# EasyEDA schematic 4BitComputerSchematic.json
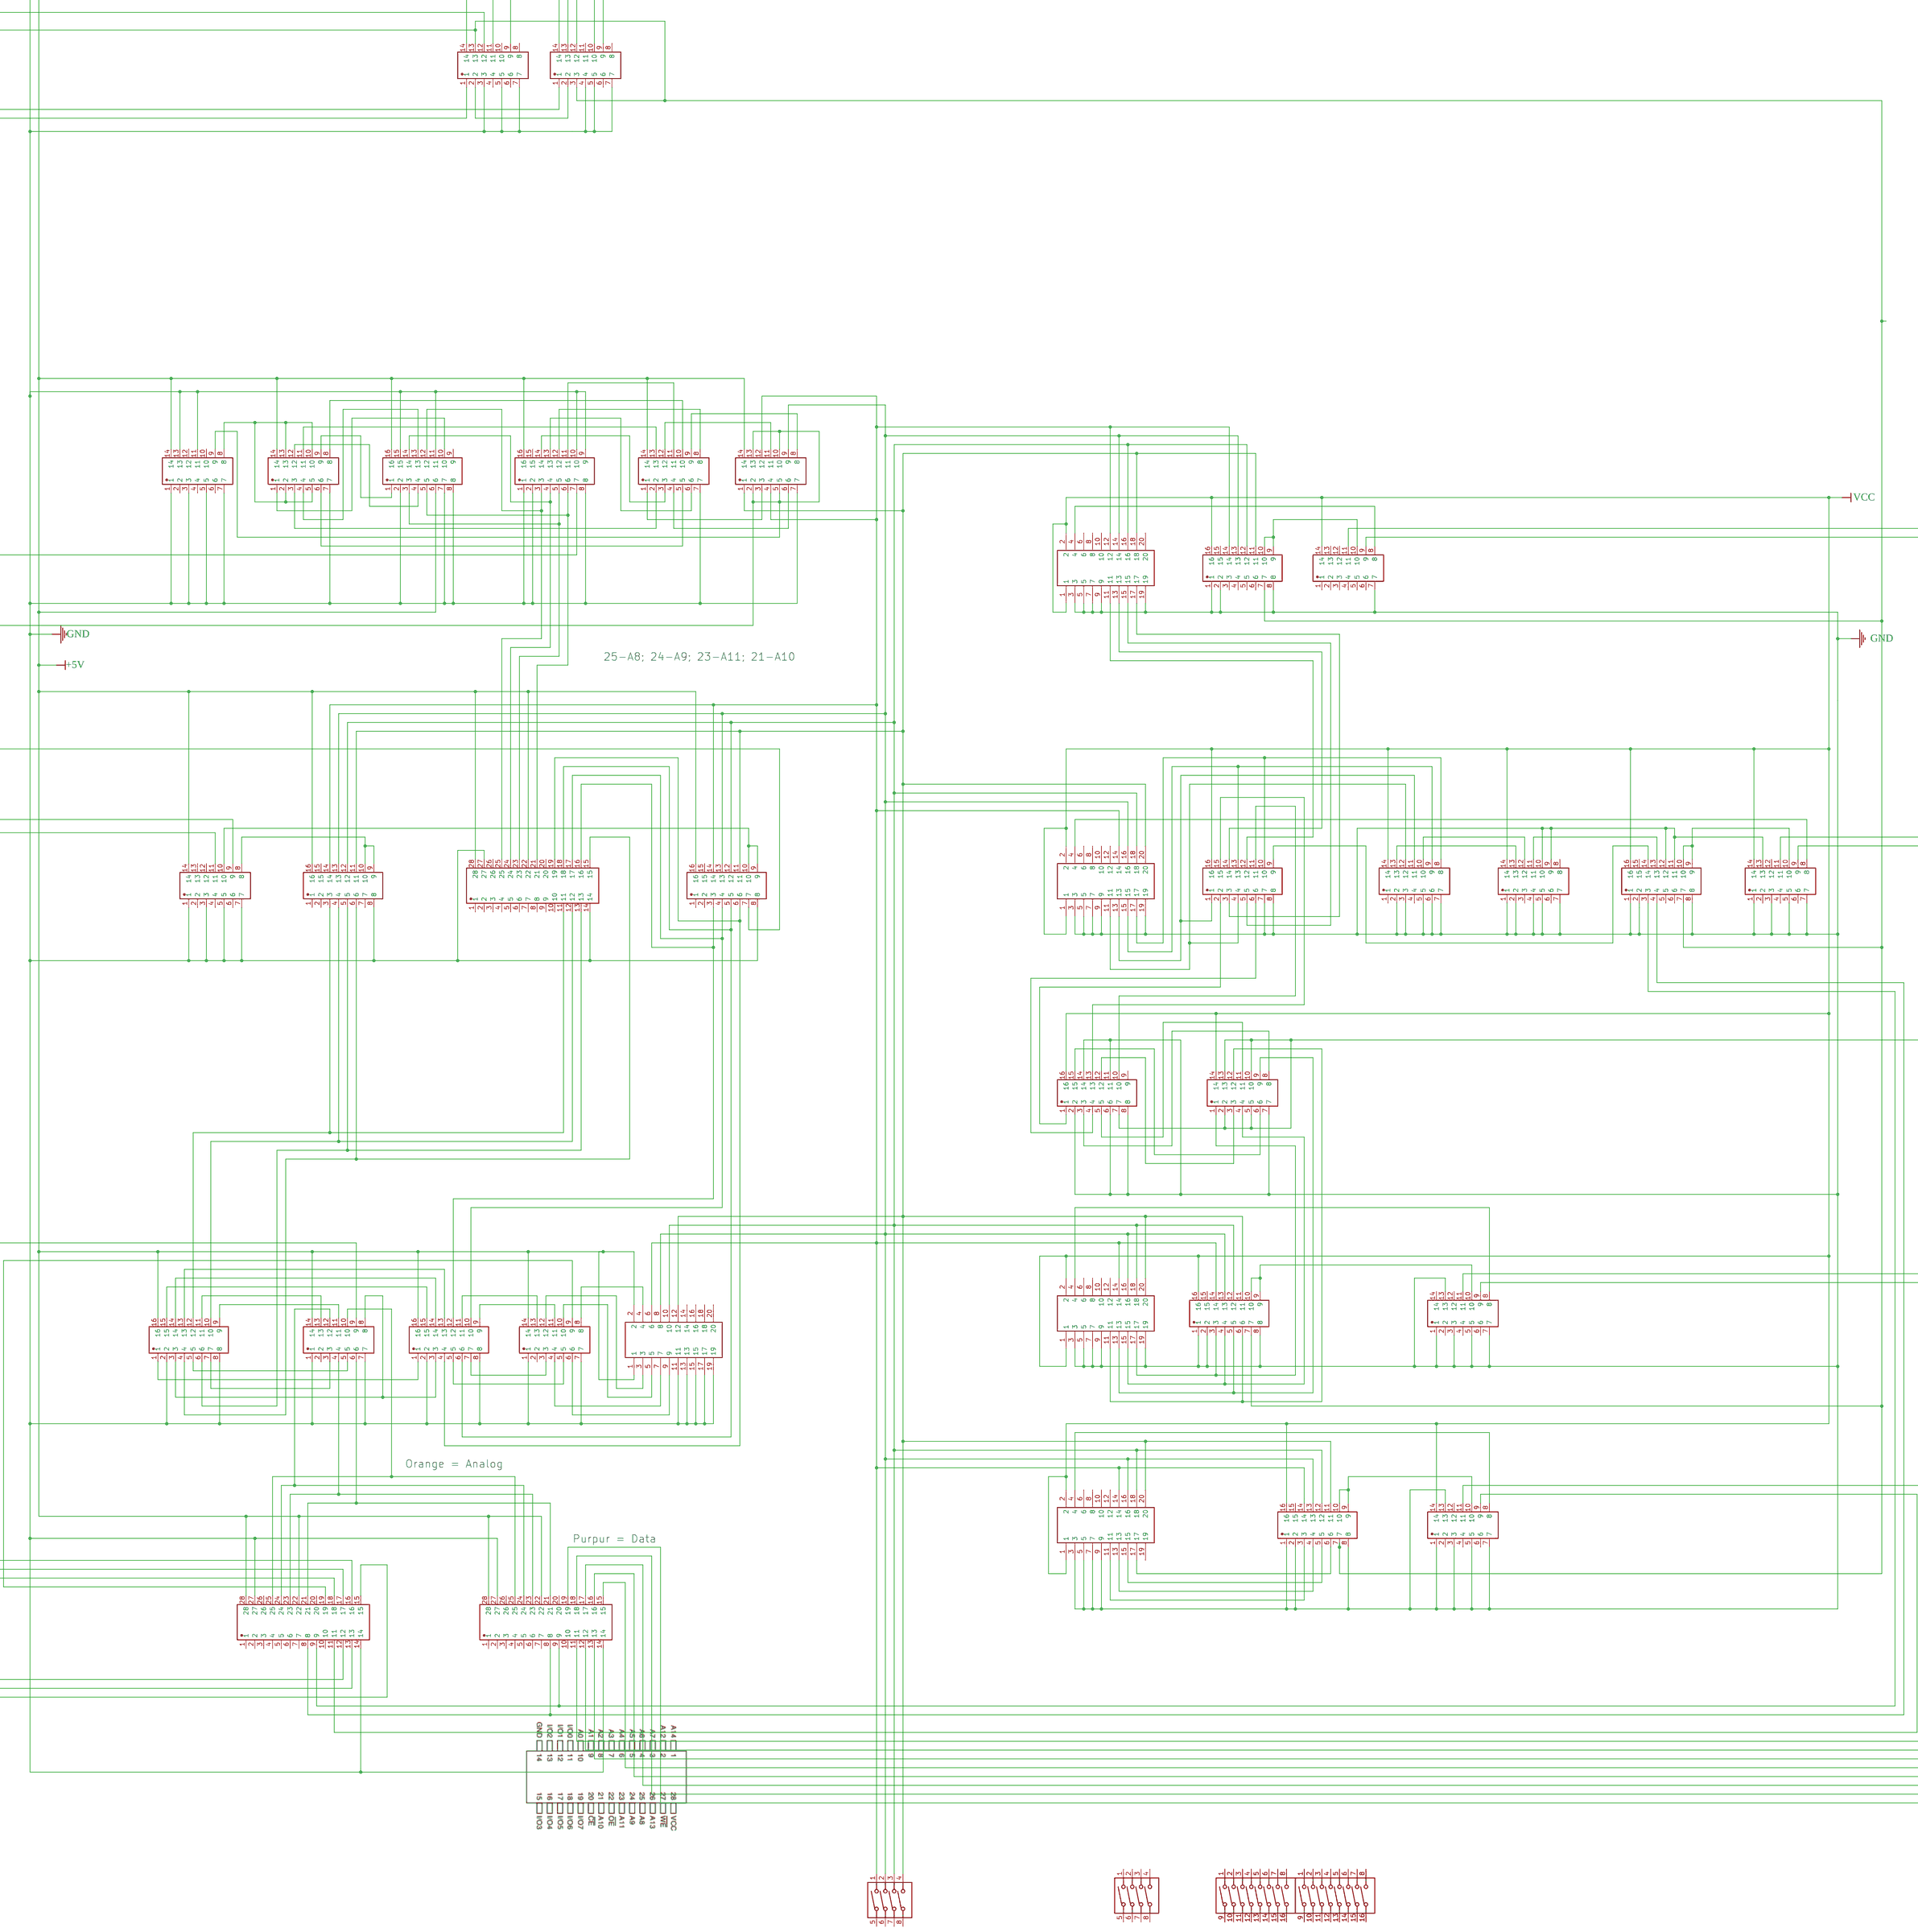
[diagram p0: schematic sheet]

## Parts
SK2  IC seat 16P  [DIP-16_L20.3-W10.2-P2.54-LS7.6-BL]
SK3  ICS-20P  [DIP-20_L25.4-W10.2-P2.54-LS10.2-BL]
SK4  ICS-20P  [DIP-20_L25.4-W10.2-P2.54-LS10.2-BL]
SK5  ICS-20P  [DIP-20_L25.4-W10.2-P2.54-LS10.2-BL]
SK7  1-2199298-3  [DIP-14_L17.8-W10.0-P2.54-BL]
SK8  1-2199298-3  [DIP-14_L17.8-W10.0-P2.54-BL]
SK9  1-2199298-3  [DIP-14_L17.8-W10.0-P2.54-BL]
SK10  1-2199298-3  [DIP-14_L17.8-W10.0-P2.54-BL]
SK11  1-2199298-3  [DIP-14_L17.8-W10.0-P2.54-BL]
SK12  1-2199298-3  [DIP-14_L17.8-W10.0-P2.54-BL]
SK13  1-2199298-3  [DIP-14_L17.8-W10.0-P2.54-BL]
SK14  1-2199298-3  [DIP-14_L17.8-W10.0-P2.54-BL]
SK15  1-2199298-3  [DIP-14_L17.8-W10.0-P2.54-BL]
SK16  1-2199298-3  [DIP-14_L17.8-W10.0-P2.54-BL]
SK21  IC seat 16P  [DIP-16_L20.3-W10.2-P2.54-LS7.6-BL]
SK22  IC seat 16P  [DIP-16_L20.3-W10.2-P2.54-LS7.6-BL]
SK23  IC seat 16P  [DIP-16_L20.3-W10.2-P2.54-LS7.6-BL]
SK26  ICS-20P  [DIP-20_L25.4-W10.2-P2.54-LS10.2-BL]
SK27  IC seat 16P  [DIP-16_L20.3-W10.2-P2.54-LS7.6-BL]
SK28  IC seat 16P  [DIP-16_L20.3-W10.2-P2.54-LS7.6-BL]
SK31  1-2199298-3  [DIP-14_L17.8-W10.0-P2.54-BL]
SK32  1-2199298-3  [DIP-14_L17.8-W10.0-P2.54-BL]
SK33  1-2199298-3  [DIP-14_L17.8-W10.0-P2.54-BL]
SK34  1-2199298-3  [DIP-14_L17.8-W10.0-P2.54-BL]
SK35  1-2199298-3  [DIP-14_L17.8-W10.0-P2.54-BL]
SK36  1-2199298-3  [DIP-14_L17.8-W10.0-P2.54-BL]
SK37  ICS-20P  [DIP-20_L25.4-W10.2-P2.54-LS10.2-BL]
SW1  DSWB08LHGET  [SW-TH_DSWB08LHGET]
SW2  DSWB08LHGET  [SW-TH_DSWB08LHGET]
SW3  DSWB04LHGET  [SW-TH_DSWB04LHGET]
SW4  DSWB04LHGET  [SW-TH_DSWB04LHGET]
U2  X5621WV-2X14-C762D1196-1196  [DIP-28_L35.6-W10.2-P2.54-LS7.6-BL]
U4  X5621WV-2X14-C762D1196-1196  [DIP-28_L35.6-W10.2-P2.54-LS7.6-BL]
U5  IC-16P  [DIP-16_L20.3-W10.2-P2.54-LS7.6-BL-1]
U6  IC-16P  [DIP-16_L20.3-W10.2-P2.54-LS7.6-BL-1]
U7  IC-16P  [DIP-16_L20.3-W10.2-P2.54-LS7.6-BL-1]
U8  IC-16P  [DIP-16_L20.3-W10.2-P2.54-LS7.6-BL-1]
U9  IC-16P  [DIP-16_L20.3-W10.2-P2.54-LS7.6-BL-1]
U10  IC-16P  [DIP-16_L20.3-W10.2-P2.54-LS7.6-BL-1]
U11  X5621WV-2X14-C762D1196-1196  [DIP-28_L35.6-W10.2-P2.54-LS7.6-BL]

## Library data of the parts
SK2 SK21-SK23 SK27 SK28 = IC seat 16P: Supplier: LCSC; Supplier Part: C2326; Manufacturer: BOOMELE(博穆精密); Manufacturer Part: IC-16P窄; Contributor: LCSC; JLCPCB Part Class: Extended Part
SK3-SK5 SK26 SK37 = ICS-20P: Supplier: LCSC; Supplier Part: C132507; Manufacturer: Ckmtw(灿科盟); Manufacturer Part: Z-ICS0S20P-NG00; Contributor: LCSC; JLCPCB Part Class: Extended Part
SK7-SK16 SK31-SK36 = 1-2199298-3: Supplier: LCSC; Supplier Part: C3034942; Manufacturer: TE Connectivity(美国泰科); Contributor: lcsc
SW1 SW2 = DSWB08LHGET: Supplier: LCSC; Supplier Part: C99413; Manufacturer: YE; Manufacturer Part: 拨码开关,平拨开关,DSWB08LHGET; Contributor: LCSC; JLCPCB Part Class: Extended Part
SW3 SW4 = DSWB04LHGET: Supplier: LCSC; Supplier Part: C99418; Manufacturer: YE; Manufacturer Part: 拨码开关,平拨开关,DSWB04LHGET; Contributor: LCSC; JLCPCB Part Class: Extended Part
U2 U4 U11 = X5621WV-2X14-C762D1196-1196: Supplier: LCSC; Supplier Part: C2883597; Manufacturer: XKB Connectivity(中国星坤); Manufacturer Part: X5621WV-2x14-C762D1196-1196; Contributor: LCSC; JLCPCB Part Class: Extended Part
U5-U10 = IC-16P: Supplier: LCSC; Supplier Part: C5289487; Manufacturer: ZHOURI(洲日); link: https://atta.szlcsc.com/upload/public/pdf/source/20221125/CA58E3030C287CE73D9114A1B28DE960.pdf; Contributor: lcsc

## Nets
+5V: SK7.14 SK11.14 SK12.14 SK31.14 SK32.14 SK33.14 SK34.14 SK35.14 SK36.14 SK37.1 SK37.2 U2.22 U2.28 U4.22 U4.28 U5.6 U5.16 U6.16 U7.16 U8.16 U9.16 U10.16 U11.22 U11.28
GND: SK2.1 SK2.2 SK2.8 SK3.3 SK3.5 SK3.7 SK3.9 SK3.19 SK4.3 SK4.5 SK4.7 SK4.9 SK4.19 SK5.3 SK5.5 SK5.7 SK5.9 SK5.19 SK7.4 SK7.5 SK7.7 SK7.9 SK7.10 SK7.12 SK7.13 SK8.2 SK8.3 SK8.5 SK8.6 SK8.7 SK9.1 SK9.3 SK9.5 SK9.7 SK9.13 SK10.7 SK11.3 SK11.5 SK11.7 SK11.9 SK11.11 SK12.1 SK12.3 SK12.5 SK12.7 SK13.1 SK13.3 SK13.5 SK13.7 SK13.13 SK14.1 SK14.3 SK14.5 SK14.7 SK14.13 SK15.7 SK16.1 SK16.2 SK16.4 SK16.5 SK16.7 SK16.9 SK16.10 SK21.7 SK21.8 SK22.1 SK22.2 SK22.8 SK23.1 SK23.2 SK23.8 SK23.11 SK23.12 SK26.3 SK26.5 SK26.7 SK26.9 SK27.1 SK27.2 SK27.8 SK28.2 SK28.6 SK28.8 SK28.11 SK28.14 SK31.1 SK31.7 SK32.1 SK32.7 SK33.1 SK33.3 SK33.5 SK33.7 SK33.11 SK33.13 SK34.7 SK35.7 SK36.7 SK37.11 SK37.13 SK37.15 SK37.17 SK37.19 U2.14 U2.27 U4.14 U4.27 U5.2 U5.7 U5.8 U5.11 U5.15 U6.1 U6.2 U6.8 U6.9 U6.10 U7.8 U8.2 U8.8 U9.2 U9.8 U10.8 U11.14 U11.27
VCC: SK2.16 SK3.1 SK3.2 SK4.1 SK4.2 SK5.1 SK5.2 SK8.14 SK9.14 SK10.14 SK13.14 SK15.14 SK16.14 SK21.16 SK22.16 SK23.16 SK26.1 SK26.2 SK27.16 SK28.16
Net-(SK2-3): SK2.3 SK26.11
Net-(SK2-4): SK2.4 SK26.13
Net-(SK2-5): SK2.5 SK26.15
Net-(SK2-6): SK2.6 SK26.17
Net-(SK2-7): SK2.7 SK7.3 SK11.13 SK22.7 SK23.7 SK27.7 U10.7
Net-(SK2-9): SK2.9 SK2.10 SK13.10
Net-(SK2-11): SK2.11 SK3.20 SK4.20 SK5.18 SK22.11 SK26.20 SK27.11 SK36.1 SK37.12 SW3.4 U7.11 U10.11
Net-(SK2-12): SK2.12 SK3.18 SK4.18 SK5.16 SK22.12 SK26.18 SK27.12 SK37.10 SW3.3 U7.12 U10.12
Net-(SK2-13): SK2.13 SK3.16 SK4.16 SK5.14 SK22.13 SK26.16 SK27.13 SK36.9 SK37.8 SW3.2 U7.13 U10.13
Net-(SK2-14): SK2.14 SK3.14 SK4.14 SK5.12 SK22.14 SK26.14 SK27.14 SK36.4 SK36.12 SK37.6 SW3.1 U7.14 U10.14
Net-(SK3-4): SK3.4 SK9.8
Net-(SK3-11): SK3.11 SK8.12 SK21.4
Net-(SK3-13): SK3.13 SK8.11 SK21.1
Net-(SK3-15): SK3.15 SK8.9 SK21.13
Net-(SK3-17): SK3.17 SK8.8 SK21.10
Net-(SK4-4): SK4.4 SK14.8
Net-(SK4-11): SK4.11 SK15.12 SK27.6
Net-(SK4-13): SK4.13 SK15.9 SK27.5
Net-(SK4-15): SK4.15 SK15.4 SK27.4
Net-(SK4-17): SK4.17 SK15.1 SK27.3
Net-(SK5-4): SK5.4 SK10.8
Net-(SK5-11): SK5.11 SK21.12
Net-(SK5-13): SK5.13 SK21.14
Net-(SK5-15): SK5.15 SK21.5
Net-(SK5-17): SK5.17 SK21.3
Net-(SK7-1): SK7.1 U11.18
Net-(SK7-2): SK7.2 SK11.2
Net-(SK8-10): SK8.10 SK16.12
Net-(SK8-13): SK8.13 SK16.13
Net-(SK9-9): SK9.9 U2.16
Net-(SK9-10): SK9.10 SK23.9 SK23.10
Net-(SK9-11): SK9.11 U2.17
Net-(SK10-9): SK10.9 U2.18
Net-(SK10-10): SK10.10 SK22.9 SK22.10
Net-(SK10-11): SK10.11 U2.19
Net-(SK11-1): SK11.1 U11.17
Net-(SK11-12): SK11.12 U6.7
Net-(SK12-8): SK12.8 U7.9 U7.10
Net-(SK12-9): SK12.9 U11.15
Net-(SK12-10): SK12.10 U10.9 U10.10
Net-(SK12-11): SK12.11 U11.13
Net-(SK13-8): SK13.8 SK26.4
Net-(SK13-9): SK13.9 U11.11
Net-(SK13-11): SK13.11 U2.11
Net-(SK14-9): SK14.9 U2.12
Net-(SK14-10): SK14.10 SK27.9 SK27.10
Net-(SK14-11): SK14.11 U2.13
Net-(SK15-2): SK15.2 SK15.5 SK15.10 SK15.13 SK28.7 U2.15
Net-(SK15-3): SK15.3 SK28.12
Net-(SK15-6): SK15.6 SK28.15
Net-(SK15-8): SK15.8 SK28.3
Net-(SK15-11): SK15.11 SK28.5
Net-(SK16-11): SK16.11 SK23.13
Net-(SK21-2): SK21.2 SK28.1
Net-(SK21-6): SK21.6 SK28.4
Net-(SK21-9): SK21.9 SK23.14
Net-(SK21-11): SK21.11 SK28.10
Net-(SK21-15): SK21.15 SK28.13
Net-(SK23-3): SK23.3 U2.9 U11.9
Net-(SK23-4): SK23.4 U2.8 U11.8
Net-(SK31-3): SK31.3 U9.7
Net-(SK31-4): SK31.4 SK37.7
Net-(SK31-5): SK31.5 U9.5
Net-(SK31-6): SK31.6 SK37.9
Net-(SK31-8): SK31.8 SK37.4
Net-(SK31-9): SK31.9 U11.19
Net-(SK31-10): SK31.10 SK37.5
Net-(SK31-11): SK31.11 U9.9
Net-(SK31-12): SK31.12 SK37.3
Net-(SK31-13): SK31.13 U9.11
Net-(SK32-3): SK32.3 U8.7
Net-(SK32-4): SK32.4 U2.23 U11.23
Net-(SK32-5): SK32.5 U8.5
Net-(SK32-6): SK32.6 U2.21 U11.21
Net-(SK32-8): SK32.8 U8.3 U9.3
Net-(SK32-9): SK32.9 U11.12
Net-(SK32-10): SK32.10 U2.25 U11.25
Net-(SK32-11): SK32.11 U8.9
Net-(SK32-12): SK32.12 U2.24 U11.24
Net-(SK32-13): SK32.13 U8.11
Net-(SK33-8): SK33.8 SK34.2 SK34.5 SK34.10 SK34.13
Net-(SK33-9): SK33.9 SK36.2 SK36.5 SK36.10 SK36.13 U11.16
Net-(SK34-1): SK34.1 U5.10
Net-(SK34-3): SK34.3 SK35.2
Net-(SK34-4): SK34.4 U5.13
Net-(SK34-6): SK34.6 SK35.5
Net-(SK34-8): SK34.8 SK35.10
Net-(SK34-9): SK34.9 U5.1
Net-(SK34-11): SK34.11 SK35.13
Net-(SK34-12): SK34.12 U5.4
Net-(SK35-1): SK35.1 SK36.3
Net-(SK35-3): SK35.3 U6.14
Net-(SK35-4): SK35.4 SK36.6
Net-(SK35-6): SK35.6 U6.13
Net-(SK35-8): SK35.8 U6.12
Net-(SK35-9): SK35.9 SK36.8
Net-(SK35-11): SK35.11 U6.11
Net-(SK35-12): SK35.12 SK36.11
Net-(U4-11): U4.11 U7.3 U8.12
Net-(U4-12): U4.12 U7.4 U8.10
Net-(U4-13): U4.13 U7.5 U8.6
Net-(U4-15): U4.15 U7.6 U8.4
Net-(U4-16): U4.16 U9.12 U10.3
Net-(U4-17): U4.17 U9.10 U10.4
Net-(U4-18): U4.18 U9.6 U10.5
Net-(U4-19): U4.19 U9.4 U10.6
Net-(U4-21): U4.21 U5.5 U6.6
Net-(U4-23): U4.23 U5.3 U6.5
Net-(U4-24): U4.24 U5.14 U6.4
Net-(U4-25): U4.25 U5.12 U6.3
Net-(U8-1): U8.1 U9.1
Net-(U8-13): U8.13 U9.13
Net-(U8-14): U8.14 U9.14
Net-(U8-15): U8.15 U9.15

Not connected (* = marked no-connect by the designer): SK2 15; SK3 6 8 10 12; SK4 6 8 10 12; SK5 6 8 10 20; SK7 6 8 11; SK8 1 4; SK9 2 4 6 12; SK10 1 2 3 4 5 6 12 13; SK11 4 6 8 10; SK12 2 4 6 12 13; SK13 2 4 6 12; SK14 2 4 6 12 14; SK16 3 6 8; SK22 3 4 5 6 15; SK23 5 6 15; SK26 6 8 10 12 19; SK27 15; SK28 9; SK31 2; SK32 2; SK33 2 4 6 10 12; SK37 14 16 18 20; SW1 1 2 3 4 5 6 7 8 9 10 11 12 13 14 15 16; SW2 1 2 3 4 5 6 7 8 9 10 11 12 13 14 15 16; SW3 5 6 7 8; SW4 1 2 3 4 5 6 7 8; U2 1 2 3 4 5 6 7 10 20 26; U4 1 2 3 4 5 6 7 8 9 10 20 26; U5 9; U6 15; U7 1 2 7 15; U10 1 2 15; U11 1 2 3 4 5 6 7 10 20 26

## Notes on the sheet
- 25-A8; 24-A9; 23-A11; 21-A10
- Orange = Analog
- Purpur = Data
